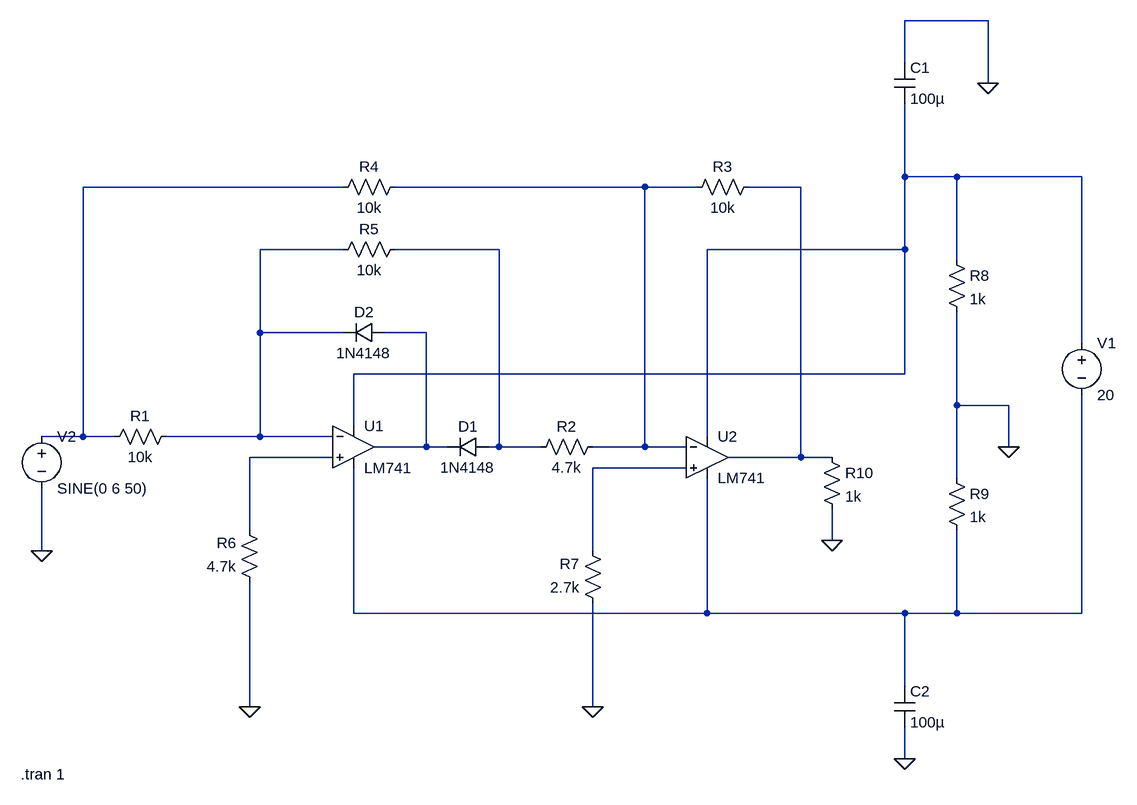
[diagram p0: schematic Draft1.asc]
Draft1.asc, the LTspice schematic file:
Version 4
SHEET 1 1192 680
WIRE 992 -528 864 -528
WIRE 864 -464 864 -528
WIRE 992 -432 992 -528
WIRE 864 -288 864 -400
WIRE 944 -288 864 -288
WIRE 1136 -288 944 -288
WIRE 0 -272 -400 -272
WIRE 464 -272 80 -272
WIRE 544 -272 464 -272
WIRE 704 -272 624 -272
WIRE 0 -176 -128 -176
WIRE 240 -176 80 -176
WIRE 864 -176 864 -288
WIRE 864 -176 560 -176
WIRE 944 -160 944 -288
WIRE -128 -48 -128 -176
WIRE 0 -48 -128 -48
WIRE 128 -48 64 -48
WIRE 1136 -32 1136 -288
WIRE 864 16 864 -176
WIRE 864 16 16 16
WIRE 944 64 944 -80
WIRE 1024 64 944 64
WIRE 16 96 16 16
WIRE -400 112 -400 -272
WIRE -400 112 -464 112
WIRE -352 112 -400 112
WIRE -128 112 -128 -48
WIRE -128 112 -272 112
WIRE -16 112 -128 112
WIRE 560 112 560 -176
WIRE 128 128 128 -48
WIRE 128 128 48 128
WIRE 160 128 128 128
WIRE 240 128 240 -176
WIRE 240 128 224 128
WIRE 304 128 240 128
WIRE 464 128 464 -272
WIRE 464 128 384 128
WIRE 528 128 464 128
WIRE 1024 128 1024 64
WIRE -16 144 -144 144
WIRE 704 144 704 -272
WIRE 704 144 592 144
WIRE 752 144 704 144
WIRE 528 160 384 160
WIRE 944 176 944 64
WIRE -144 256 -144 144
WIRE 752 272 752 224
WIRE -464 288 -464 192
WIRE 384 288 384 160
WIRE 16 384 16 160
WIRE 560 384 560 176
WIRE 560 384 16 384
WIRE 864 384 560 384
WIRE 944 384 944 256
WIRE 944 384 864 384
WIRE 1136 384 1136 48
WIRE 1136 384 944 384
WIRE 864 496 864 384
WIRE -144 528 -144 336
WIRE 384 528 384 368
WIRE 864 608 864 560
FLAG -144 528 0
FLAG 384 528 0
FLAG 1024 128 0
FLAG 864 608 0
FLAG 992 -432 0
FLAG -464 288 0
FLAG 752 272 0
SYMBOL LM741 16 64 R0
SYMATTR InstName U1
SYMBOL LM741 560 80 R0
SYMATTR InstName U2
SYMBOL res -256 96 R90
WINDOW 0 0 56 VBottom 2
WINDOW 3 32 56 VTop 2
SYMATTR InstName R1
SYMATTR Value 10k
SYMBOL res 400 112 R90
WINDOW 0 0 56 VBottom 2
WINDOW 3 32 56 VTop 2
SYMATTR InstName R2
SYMATTR Value 4.7k
SYMBOL res 640 -288 R90
WINDOW 0 0 56 VBottom 2
WINDOW 3 32 56 VTop 2
SYMATTR InstName R3
SYMATTR Value 10k
SYMBOL res 96 -288 R90
WINDOW 0 0 56 VBottom 2
WINDOW 3 32 56 VTop 2
SYMATTR InstName R4
SYMATTR Value 10k
SYMBOL res 96 -192 R90
WINDOW 0 0 56 VBottom 2
WINDOW 3 32 56 VTop 2
SYMATTR InstName R5
SYMATTR Value 10k
SYMBOL res -128 352 R180
WINDOW 0 36 76 Left 2
WINDOW 3 36 40 Left 2
SYMATTR InstName R6
SYMATTR Value 4.7k
SYMBOL res 400 384 R180
WINDOW 0 36 76 Left 2
WINDOW 3 36 40 Left 2
SYMATTR InstName R7
SYMATTR Value 2.7k
SYMBOL diode 224 112 R90
WINDOW 0 0 32 VBottom 2
WINDOW 3 32 32 VTop 2
SYMATTR InstName D1
SYMATTR Value 1N4148
SYMBOL diode 64 -64 R90
WINDOW 0 0 32 VBottom 2
WINDOW 3 32 32 VTop 2
SYMATTR InstName D2
SYMATTR Value 1N4148
SYMBOL res 928 -176 R0
SYMATTR InstName R8
SYMATTR Value 1k
SYMBOL res 928 160 R0
SYMATTR InstName R9
SYMATTR Value 1k
SYMBOL voltage 1136 -48 R0
WINDOW 123 0 0 Left 0
WINDOW 39 0 0 Left 0
SYMATTR InstName V1
SYMATTR Value 20
SYMBOL voltage -464 96 R0
WINDOW 123 0 0 Left 0
WINDOW 39 0 0 Left 0
SYMATTR InstName V2
SYMATTR Value SINE(0 6 50)
SYMBOL cap 848 -464 R0
SYMATTR InstName C1
SYMATTR Value 100µ
SYMBOL cap 848 496 R0
SYMATTR InstName C2
SYMATTR Value 100µ
SYMBOL res 736 128 R0
SYMATTR InstName R10
SYMATTR Value 1k
TEXT -496 632 Left 2 !.tran 1

The netlist it stands for:
* Draft1.asc
XU1 N008 N005 N001 N010 N007 LM741  ; pins In+ In- V+ V- OUT
XU2 N009 N003 N001 N010 N004 LM741  ; pins In+ In- V+ V- OUT
R1 N005 N002 10k
R2 N003 N006 4.7k
R3 N004 N003 10k
R4 N003 N002 10k
R5 N006 N005 10k
R6 0 N008 4.7k
R7 0 N009 2.7k
D1 N006 N007 1N4148
D2 N007 N005 1N4148
R8 N001 0 1k
R9 0 N010 1k
V1 N001 N010 20
V2 N002 0 SINE(0 6 50)
C1 0 N001 100µ
C2 N010 0 100µ
R10 N004 0 1k
.model D D
.lib standard.dio
.tran 1
.lib LM741.lib
.backanno
.end